# EasyEDA schematic SCH_A320-MCDU-SMD_2024-02-10.json
TITLE: Sheet_1; REV: 1.0; Date: 2021-11-16; Sheet: 1/1; Drawn By: madmonkeyfpv; Company: Your Company
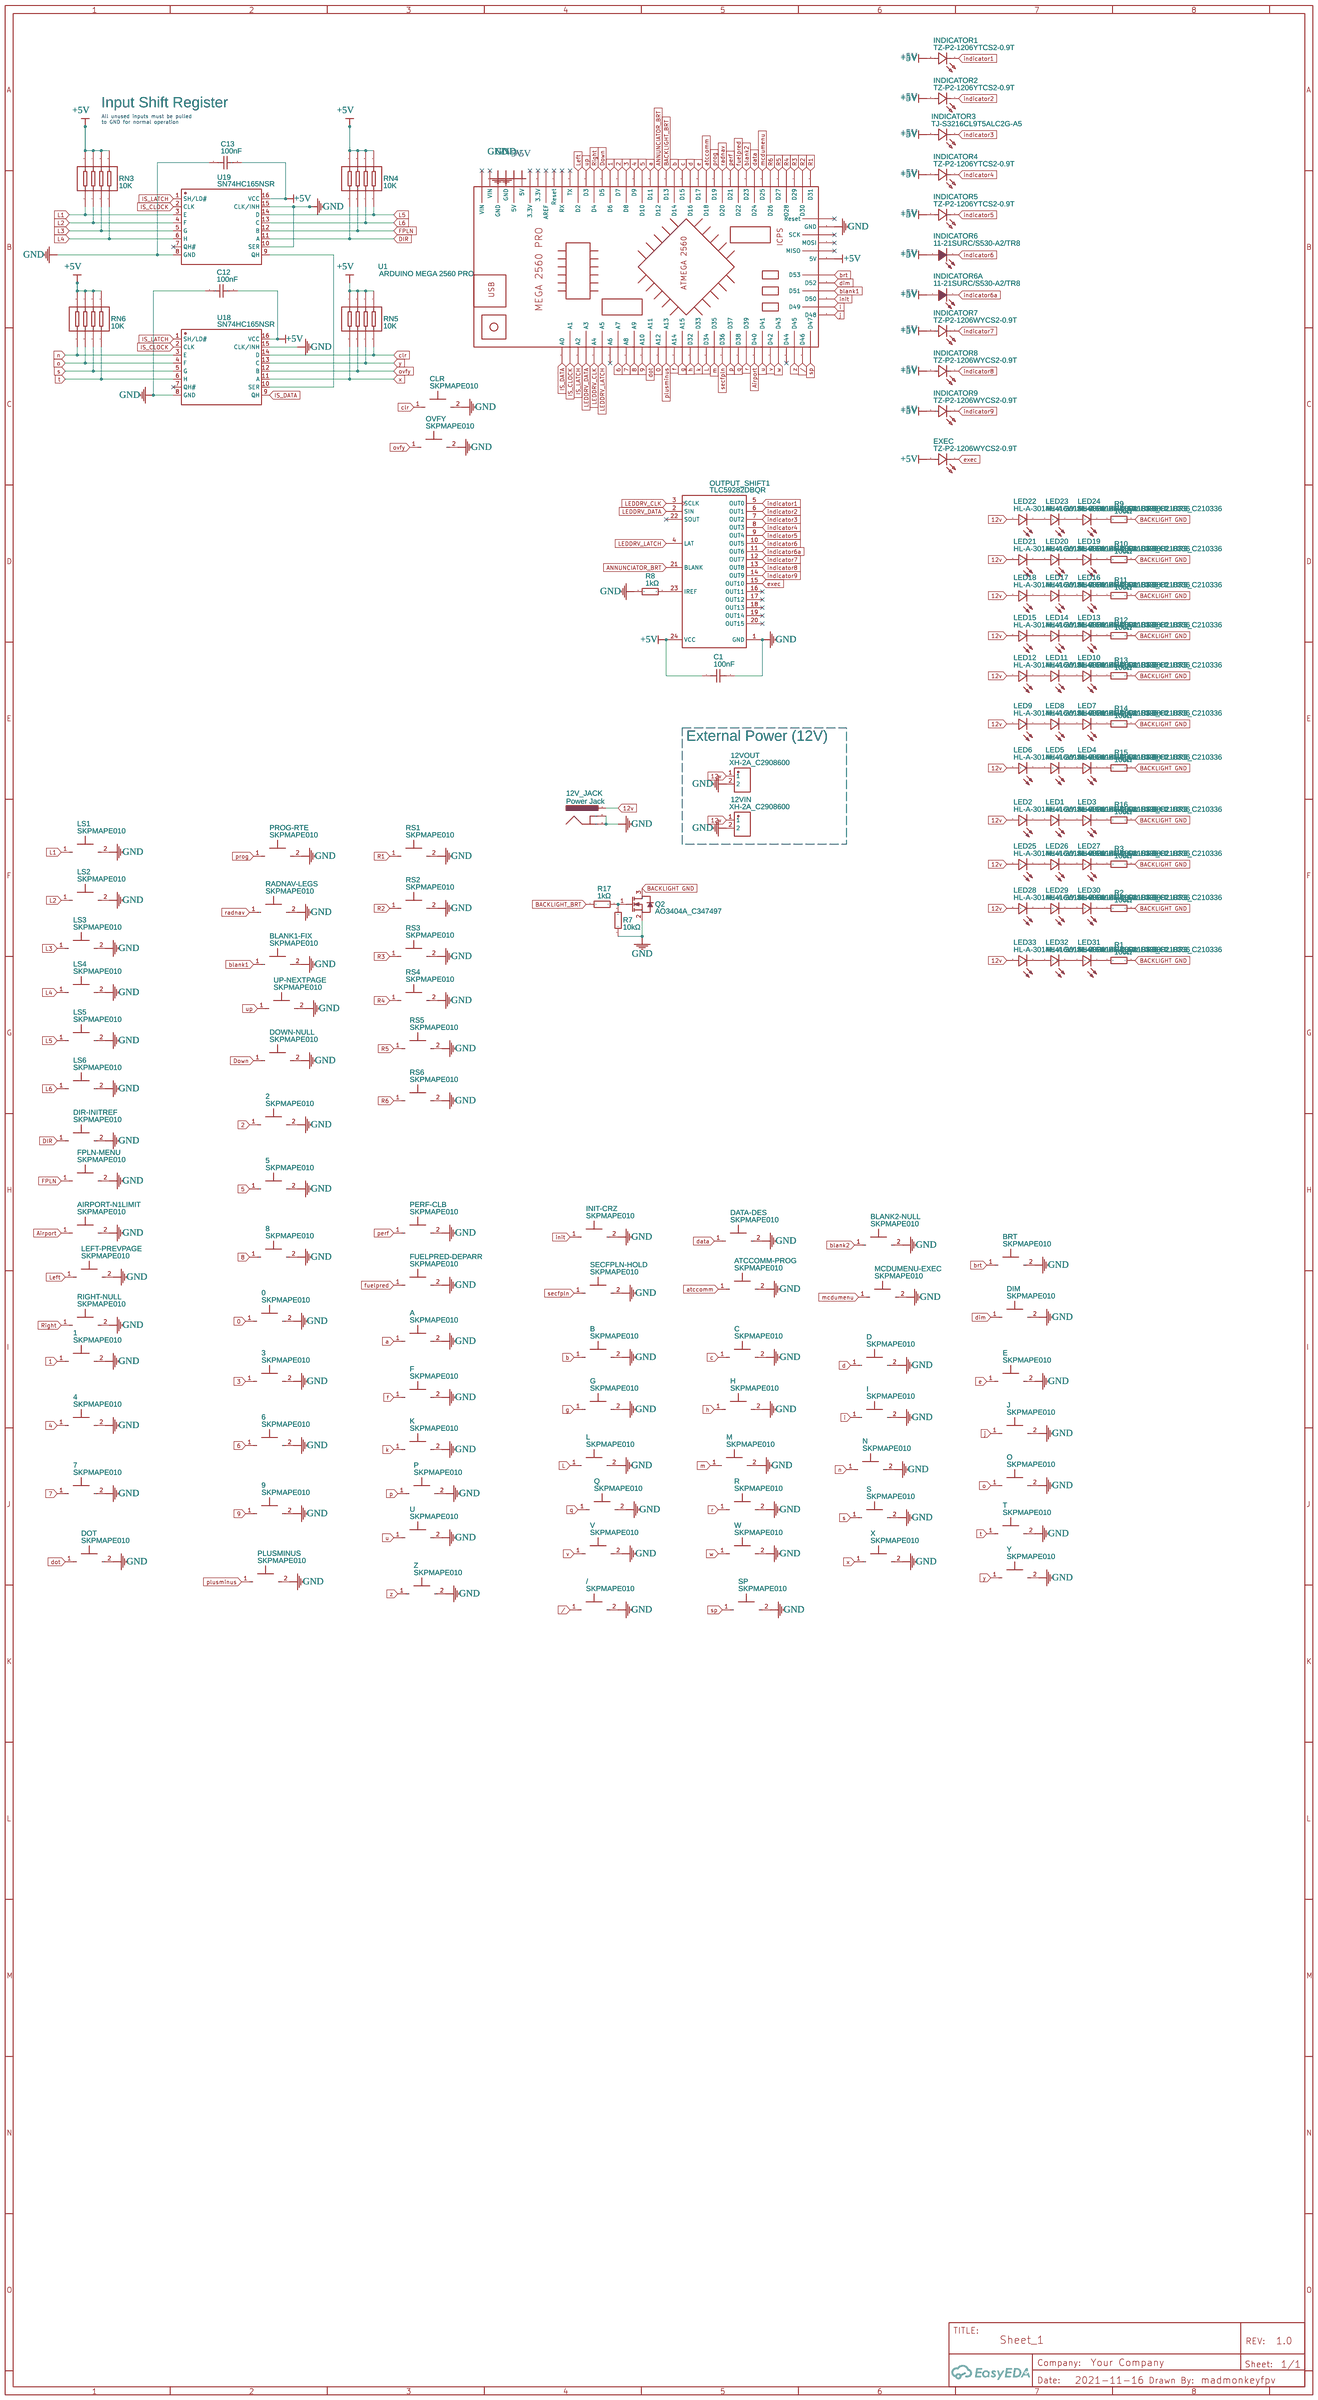
[diagram p0: schematic sheet]

## Parts
0  SKPMAPE010  [KEY-SMD_2P-L6.0-W6.0-P6.00]
1  SKPMAPE010  [KEY-SMD_2P-L6.0-W6.0-P6.00]
2  SKPMAPE010  [KEY-SMD_2P-L6.0-W6.0-P6.00]
3  SKPMAPE010  [KEY-SMD_2P-L6.0-W6.0-P6.00]
4  SKPMAPE010  [KEY-SMD_2P-L6.0-W6.0-P6.00]
5  SKPMAPE010  [KEY-SMD_2P-L6.0-W6.0-P6.00]
6  SKPMAPE010  [KEY-SMD_2P-L6.0-W6.0-P6.00]
7  SKPMAPE010  [KEY-SMD_2P-L6.0-W6.0-P6.00]
8  SKPMAPE010  [KEY-SMD_2P-L6.0-W6.0-P6.00]
9  SKPMAPE010  [KEY-SMD_2P-L6.0-W6.0-P6.00]
12V_JACK  Power Jack  [BARREL_JACK_SLOTTED_HOLES]
12VIN  XH-2A_C2908600  [CONN-TH_2P-P2.50_HCTL_XH-2A-X]
12VOUT  XH-2A_C2908600  [CONN-TH_2P-P2.50_HCTL_XH-2A-X]
/  SKPMAPE010  [KEY-SMD_2P-L6.0-W6.0-P6.00]
A  SKPMAPE010  [KEY-SMD_2P-L6.0-W6.0-P6.00]
AIRPORT-N1LIMIT  SKPMAPE010  [KEY-SMD_2P-L6.0-W6.0-P6.00]
ATCCOMM-PROG  SKPMAPE010  [KEY-SMD_2P-L6.0-W6.0-P6.00]
B  SKPMAPE010  [KEY-SMD_2P-L6.0-W6.0-P6.00]
BLANK1-FIX  SKPMAPE010  [KEY-SMD_2P-L6.0-W6.0-P6.00]
BLANK2-NULL  SKPMAPE010  [KEY-SMD_2P-L6.0-W6.0-P6.00]
BRT  SKPMAPE010  [KEY-SMD_2P-L6.0-W6.0-P6.00]
C  SKPMAPE010  [KEY-SMD_2P-L6.0-W6.0-P6.00]
C1  100nF  [C0603]
C12  100nF  [C0603]
C13  100nF  [C0603]
CLR  SKPMAPE010  [KEY-SMD_2P-L6.0-W6.0-P6.00]
D  SKPMAPE010  [KEY-SMD_2P-L6.0-W6.0-P6.00]
DATA-DES  SKPMAPE010  [KEY-SMD_2P-L6.0-W6.0-P6.00]
DIM  SKPMAPE010  [KEY-SMD_2P-L6.0-W6.0-P6.00]
DIR-INITREF  SKPMAPE010  [KEY-SMD_2P-L6.0-W6.0-P6.00]
DOT  SKPMAPE010  [KEY-SMD_2P-L6.0-W6.0-P6.00]
DOWN-NULL  SKPMAPE010  [KEY-SMD_2P-L6.0-W6.0-P6.00]
E  SKPMAPE010  [KEY-SMD_2P-L6.0-W6.0-P6.00]
EXEC  TZ-P2-1206WYCS2-0.9T  [LED1206-RD_WHITE]
F  SKPMAPE010  [KEY-SMD_2P-L6.0-W6.0-P6.00]
FPLN-MENU  SKPMAPE010  [KEY-SMD_2P-L6.0-W6.0-P6.00]
FUELPRED-DEPARR  SKPMAPE010  [KEY-SMD_2P-L6.0-W6.0-P6.00]
G  SKPMAPE010  [KEY-SMD_2P-L6.0-W6.0-P6.00]
H  SKPMAPE010  [KEY-SMD_2P-L6.0-W6.0-P6.00]
I  SKPMAPE010  [KEY-SMD_2P-L6.0-W6.0-P6.00]
INDICATOR1  TZ-P2-1206YTCS2-0.9T  [LED1206-RD_YELLOW-1]
INDICATOR2  TZ-P2-1206YTCS2-0.9T  [LED1206-RD_YELLOW-1]
INDICATOR3  TJ-S3216CL9T5ALC2G-A5  [LED1206-RD_GREEN]
INDICATOR4  TZ-P2-1206YTCS2-0.9T  [LED1206-RD_YELLOW-1]
INDICATOR5  TZ-P2-1206YTCS2-0.9T  [LED1206-RD_YELLOW-1]
INDICATOR6  11-21SURC/S530-A2/TR8  [LED1206-R-RD_RED]
INDICATOR6A  11-21SURC/S530-A2/TR8  [LED1206-R-RD_RED]
INDICATOR7  TZ-P2-1206WYCS2-0.9T  [LED1206-RD_WHITE]
INDICATOR8  TZ-P2-1206WYCS2-0.9T  [LED1206-RD_WHITE]
INDICATOR9  TZ-P2-1206WYCS2-0.9T  [LED1206-RD_WHITE]
INIT-CRZ  SKPMAPE010  [KEY-SMD_2P-L6.0-W6.0-P6.00]
J  SKPMAPE010  [KEY-SMD_2P-L6.0-W6.0-P6.00]
K  SKPMAPE010  [KEY-SMD_2P-L6.0-W6.0-P6.00]
L  SKPMAPE010  [KEY-SMD_2P-L6.0-W6.0-P6.00]
LED1  HL-A-3014H416W-S1-08HL-HR3_C210336  [LED3014-RD]
LED2  HL-A-3014H416W-S1-08HL-HR3_C210336  [LED3014-RD]
LED3  HL-A-3014H416W-S1-08HL-HR3_C210336  [LED3014-RD]
LED4  HL-A-3014H416W-S1-08HL-HR3_C210336  [LED3014-RD]
LED5  HL-A-3014H416W-S1-08HL-HR3_C210336  [LED3014-RD]
LED6  HL-A-3014H416W-S1-08HL-HR3_C210336  [LED3014-RD]
LED7  HL-A-3014H416W-S1-08HL-HR3_C210336  [LED3014-RD]
LED8  HL-A-3014H416W-S1-08HL-HR3_C210336  [LED3014-RD]
LED9  HL-A-3014H416W-S1-08HL-HR3_C210336  [LED3014-RD]
LED10  HL-A-3014H416W-S1-08HL-HR3_C210336  [LED3014-RD]
LED11  HL-A-3014H416W-S1-08HL-HR3_C210336  [LED3014-RD]
LED12  HL-A-3014H416W-S1-08HL-HR3_C210336  [LED3014-RD]
LED13  HL-A-3014H416W-S1-08HL-HR3_C210336  [LED3014-RD]
LED14  HL-A-3014H416W-S1-08HL-HR3_C210336  [LED3014-RD]
LED15  HL-A-3014H416W-S1-08HL-HR3_C210336  [LED3014-RD]
LED16  HL-A-3014H416W-S1-08HL-HR3_C210336  [LED3014-RD]
LED17  HL-A-3014H416W-S1-08HL-HR3_C210336  [LED3014-RD]
LED18  HL-A-3014H416W-S1-08HL-HR3_C210336  [LED3014-RD]
LED19  HL-A-3014H416W-S1-08HL-HR3_C210336  [LED3014-RD]
LED20  HL-A-3014H416W-S1-08HL-HR3_C210336  [LED3014-RD]
LED21  HL-A-3014H416W-S1-08HL-HR3_C210336  [LED3014-RD]
LED22  HL-A-3014H416W-S1-08HL-HR3_C210336  [LED3014-RD]
LED23  HL-A-3014H416W-S1-08HL-HR3_C210336  [LED3014-RD]
LED24  HL-A-3014H416W-S1-08HL-HR3_C210336  [LED3014-RD]
LED25  HL-A-3014H416W-S1-08HL-HR3_C210336  [LED3014-RD]
LED26  HL-A-3014H416W-S1-08HL-HR3_C210336  [LED3014-RD]
LED27  HL-A-3014H416W-S1-08HL-HR3_C210336  [LED3014-RD]
LED28  HL-A-3014H416W-S1-08HL-HR3_C210336  [LED3014-RD]
LED29  HL-A-3014H416W-S1-08HL-HR3_C210336  [LED3014-RD]
LED30  HL-A-3014H416W-S1-08HL-HR3_C210336  [LED3014-RD]
LED31  HL-A-3014H416W-S1-08HL-HR3_C210336  [LED3014-RD]
LED32  HL-A-3014H416W-S1-08HL-HR3_C210336  [LED3014-RD]
LED33  HL-A-3014H416W-S1-08HL-HR3_C210336  [LED3014-RD]
LEFT-PREVPAGE  SKPMAPE010  [KEY-SMD_2P-L6.0-W6.0-P6.00]
LS1  SKPMAPE010  [KEY-SMD_2P-L6.0-W6.0-P6.00]
LS2  SKPMAPE010  [KEY-SMD_2P-L6.0-W6.0-P6.00]
LS3  SKPMAPE010  [KEY-SMD_2P-L6.0-W6.0-P6.00]
LS4  SKPMAPE010  [KEY-SMD_2P-L6.0-W6.0-P6.00]
LS5  SKPMAPE010  [KEY-SMD_2P-L6.0-W6.0-P6.00]
LS6  SKPMAPE010  [KEY-SMD_2P-L6.0-W6.0-P6.00]
M  SKPMAPE010  [KEY-SMD_2P-L6.0-W6.0-P6.00]
MCDUMENU-EXEC  SKPMAPE010  [KEY-SMD_2P-L6.0-W6.0-P6.00]
N  SKPMAPE010  [KEY-SMD_2P-L6.0-W6.0-P6.00]
O  SKPMAPE010  [KEY-SMD_2P-L6.0-W6.0-P6.00]
OUTPUT_SHIFT1  TLC59282DBQR  [SSOP-24_L8.8-W4.0-P0.64-LS6.2-BL]
OVFY  SKPMAPE010  [KEY-SMD_2P-L6.0-W6.0-P6.00]
P  SKPMAPE010  [KEY-SMD_2P-L6.0-W6.0-P6.00]
PERF-CLB  SKPMAPE010  [KEY-SMD_2P-L6.0-W6.0-P6.00]
PLUSMINUS  SKPMAPE010  [KEY-SMD_2P-L6.0-W6.0-P6.00]
PROG-RTE  SKPMAPE010  [KEY-SMD_2P-L6.0-W6.0-P6.00]
Q  SKPMAPE010  [KEY-SMD_2P-L6.0-W6.0-P6.00]
Q2  AO3404A_C347497  [SOT-23-3_L3.0-W1.7-P0.95-LS2.9-BR]
R  SKPMAPE010  [KEY-SMD_2P-L6.0-W6.0-P6.00]
R1  100Ω  [R1206]
R2  100Ω  [R1206]
R3  100Ω  [R1206]
R7  10kΩ  [R1206]
R8  1kΩ  [R1206]
R9  100Ω  [R1206]
R10  100Ω  [R1206]
R11  100Ω  [R1206]
R12  100Ω  [R1206]
R13  100Ω  [R1206]
R14  100Ω  [R1206]
R15  100Ω  [R1206]
R16  100Ω  [R1206]
R17  1kΩ  [R1206]
RADNAV-LEGS  SKPMAPE010  [KEY-SMD_2P-L6.0-W6.0-P6.00]
RIGHT-NULL  SKPMAPE010  [KEY-SMD_2P-L6.0-W6.0-P6.00]
RN3  10K  [RES-ARRAY-SMD_0603-8P-L3.2-W1.6-BL]
RN4  10K  [RES-ARRAY-SMD_0603-8P-L3.2-W1.6-BL]
RN5  10K  [RES-ARRAY-SMD_0603-8P-L3.2-W1.6-BL]
RN6  10K  [RES-ARRAY-SMD_0603-8P-L3.2-W1.6-BL]
RS1  SKPMAPE010  [KEY-SMD_2P-L6.0-W6.0-P6.00]
RS2  SKPMAPE010  [KEY-SMD_2P-L6.0-W6.0-P6.00]
RS3  SKPMAPE010  [KEY-SMD_2P-L6.0-W6.0-P6.00]
RS4  SKPMAPE010  [KEY-SMD_2P-L6.0-W6.0-P6.00]
RS5  SKPMAPE010  [KEY-SMD_2P-L6.0-W6.0-P6.00]
RS6  SKPMAPE010  [KEY-SMD_2P-L6.0-W6.0-P6.00]
S  SKPMAPE010  [KEY-SMD_2P-L6.0-W6.0-P6.00]
SECFPLN-HOLD  SKPMAPE010  [KEY-SMD_2P-L6.0-W6.0-P6.00]
SP  SKPMAPE010  [KEY-SMD_2P-L6.0-W6.0-P6.00]
T  SKPMAPE010  [KEY-SMD_2P-L6.0-W6.0-P6.00]
U  SKPMAPE010  [KEY-SMD_2P-L6.0-W6.0-P6.00]
U1  ARDUINO MEGA 2560 PRO  [ARDUINO MEGA 2560 PRO]
U18  SN74HC165NSR  [SOP-16_L10.3-W5.4-P1.27-LS7.8-BL]
U19  SN74HC165NSR  [SOP-16_L10.3-W5.4-P1.27-LS7.8-BL]
UP-NEXTPAGE  SKPMAPE010  [KEY-SMD_2P-L6.0-W6.0-P6.00]
V  SKPMAPE010  [KEY-SMD_2P-L6.0-W6.0-P6.00]
W  SKPMAPE010  [KEY-SMD_2P-L6.0-W6.0-P6.00]
X  SKPMAPE010  [KEY-SMD_2P-L6.0-W6.0-P6.00]
Y  SKPMAPE010  [KEY-SMD_2P-L6.0-W6.0-P6.00]
Z  SKPMAPE010  [KEY-SMD_2P-L6.0-W6.0-P6.00]

## Library data of the parts
0-9 / A AIRPORT-N1LIMIT ATCCOMM-PROG B BLANK1-FIX BLANK2-NULL BRT C CLR D DATA-DES DIM DIR-INITREF DOT DOWN-NULL E F FPLN-MENU FUELPRED-DEPARR G H I INIT-CRZ J K L LEFT-PREVPAGE LS1-LS6 M MCDUMENU-EXEC N O OVFY P PERF-CLB PLUSMINUS PROG-RTE Q R RADNAV-LEGS RIGHT-NULL RS1-RS6 S SECFPLN-HOLD SP T U UP-NEXTPAGE V W X Y Z = SKPMAPE010: Supplier: LCSC; Manufacturer: ALPS; Supplier Part: C110292; JLCPCB Part Class: Extended Part
12V_JACK = POWER_JACK: Contributor: SparkFun; Supplier: Tayda Electronics; Supplier Part: A-4118; Manufacturer: Wealth Metal; Package Display: No
12VIN 12VOUT = XH-2A_C2908600: Supplier: LCSC; Supplier Part: C2908600; Manufacturer: HCTL(华灿天禄); Manufacturer Part: XH-2A; Contributor: LCSC; JLCPCB Part Class: Extended Part
C1 C12 C13 = CC0603KRX7R9BB104: Supplier: LCSC; Manufacturer: YAGEO; Supplier Part: C14663; JLCPCB Part Class: Basic Part
EXEC INDICATOR7-INDICATOR9 = TZ-P2-1206WYCS2-0.9T: Supplier: LCSC; Supplier Part: C779809; Manufacturer: TUOZHAN; Contributor: LCSC; JLCPCB Part Class: Extended Part
INDICATOR1 INDICATOR2 INDICATOR4 INDICATOR5 = TZ-P2-1206YTCS2-0.9T: Supplier: LCSC; Supplier Part: C779811; Manufacturer: TUOZHAN; Contributor: LCSC; JLCPCB Part Class: Extended Part
INDICATOR3 = TJ-S3216CL9T5ALC2G-A5: Supplier: LCSC; Supplier Part: C917196; Manufacturer: TOGIALED; Contributor: LCSC; JLCPCB Part Class: Extended Part
INDICATOR6 INDICATOR6A = 11-21SURC/S530-A2/TR8: Supplier: LCSC; Supplier Part: C264315; Manufacturer: Everlight Elec; Contributor: LCSC; JLCPCB Part Class: Extended Part
LED1-LED33 = HL-A-3014H416W-S1-08HL-HR3_C210336: Supplier: LCSC; Supplier Part: C210336; Manufacturer: Hongli Zhihui (HONGLITRONIC); Contributor: LCSC; JLCPCB Part Class: Extended Part
OUTPUT_SHIFT1 = TLC59282DBQR: Supplier: LCSC; Manufacturer: TI(德州仪器); Supplier Part: C129352; JLCPCB Part Class: Extended Part
Q2 = AO3404A_C347497: Supplier: LCSC; Supplier Part: C347497; Manufacturer: Youtai Semiconductor Co., Ltd.; Manufacturer Part: AO3404A; Contributor: LCSC; JLCPCB Part Class: Extended Part
R1-R3 R9-R16 = 1206W4F1000T5E: Supplier: LCSC; Manufacturer: UniOhm; Supplier Part: C17901; Resistance (Ohms): 100; JLCPCB Part Class: Basic Part
R7 = 1206W4F1002T5E: Supplier: LCSC; Manufacturer: UniOhm; Supplier Part: C17902; Resistance (Ohms): 10K; JLCPCB Part Class: Basic Part
R8 R17 = 1206W4F1001T5E: Supplier: LCSC; Manufacturer: UniOhm; Supplier Part: C4410; Resistance (Ohms): 1K; JLCPCB Part Class: Basic Part
RN3-RN6 = YC164-FR-0710KL: Supplier: LCSC; Manufacturer: YAGEO; Supplier Part: C110924; JLCPCB Part Class: Extended Part; Resistance: 10kΩ
U1 = ARDUINO MEGA 2560 PRO: Manufacturer Part: Arduino Mega 2560 Pro Mini; link: https://www.arduino.cc; Contributor: DEVAZ
U18 U19 = SN74HC165NSR: Supplier: LCSC; Manufacturer: TI; Supplier Part: C129935; JLCPCB Part Class: Extended Part

## Nets
12v: 12V_JACK.PWR 12VIN.1 12VOUT.1 LED2.2 LED6.2 LED9.2 LED12.2 LED15.2 LED18.2 LED21.2 LED22.2 LED25.2 LED28.2 LED33.2
+5V: C1.1 C12.2 C13.2 EXEC.2(A) INDICATOR1.2(A) INDICATOR2.2(A) INDICATOR3.2(A) INDICATOR4.2(A) INDICATOR5.2(A) INDICATOR6.1(A) INDICATOR6A.1(A) INDICATOR7.2(A) INDICATOR8.2(A) INDICATOR9.2(A) OUTPUT_SHIFT1.24(VCC) RN3.5 RN3.6 RN3.7 RN3.8 RN4.1 RN4.2 RN4.3 RN4.4 RN5.1 RN5.2 RN5.3 RN5.4 RN6.5 RN6.6 RN6.7 RN6.8 U1.39(5V) U1.81(5V) U1.82(5V) U18.16(VCC) U19.16(VCC)
GND: 0.2 1.2 2.2 3.2 4.2 5.2 6.2 7.2 8.2 9.2 12V_JACK.GND 12V_JACK.GNDBREAK 12VIN.2 12VOUT.2 /.2 A.2 AIRPORT-N1LIMIT.2 ATCCOMM-PROG.2 B.2 BLANK1-FIX.2 BLANK2-NULL.2 BRT.2 C.2 C1.2 C12.1 C13.1 CLR.2 D.2 DATA-DES.2 DIM.2 DIR-INITREF.2 DOT.2 DOWN-NULL.2 E.2 F.2 FPLN-MENU.2 FUELPRED-DEPARR.2 G.2 H.2 I.2 INIT-CRZ.2 J.2 K.2 L.2 LEFT-PREVPAGE.2 LS1.2 LS2.2 LS3.2 LS4.2 LS5.2 LS6.2 M.2 MCDUMENU-EXEC.2 N.2 O.2 OUTPUT_SHIFT1.1(GND) OVFY.2 P.2 PERF-CLB.2 PLUSMINUS.2 PROG-RTE.2 Q.2 Q2.2(S) R.2 R7.1 R8.2 RADNAV-LEGS.2 RIGHT-NULL.2 RS1.2 RS2.2 RS3.2 RS4.2 RS5.2 RS6.2 S.2 SECFPLN-HOLD.2 SP.2 T.2 U.2 U1.43(GND) U1.83(GND) U1.84(GND) U18.8(GND) U18.15(CLK/INH) U19.8(GND) U19.10(SER) U19.15(CLK/INH) UP-NEXTPAGE.2 V.2 W.2 X.2 Y.2 Z.2
0: 0.1 U1.13(A12)
1: 1.1 U1.70(D6)
2: 2.1 U1.69(D7)
3: 3.1 U1.68(D8)
4: 4.1 U1.67(D9)
5: 5.1 U1.66(D10)
6: 6.1 U1.8(A7)
7: 7.1 U1.9(A8)
8: 8.1 U1.10(A9)
9: 9.1 U1.11(A10)
/: /.1 U1.31(D46)
a: A.1 U1.65(D11)
Airport: AIRPORT-N1LIMIT.1 U1.25(D40)
ANNUNCIATOR_BRT: OUTPUT_SHIFT1.21(BLANK) U1.64(D12)
atccomm: ATCCOMM-PROG.1 U1.58(D18)
b: B.1 U1.62(D14)
BACKLIGHT GND: Q2.3(D) R1.2 R2.2 R3.2 R9.2 R10.2 R11.2 R12.2 R13.2 R14.2 R15.2 R16.2
BACKLIGHT_BRT: R17.1 U1.63(D13)
blank1: BLANK1-FIX.1 U1.36(D51)
blank2: BLANK2-NULL.1 U1.53(D23)
brt: BRT.1 U1.38(D53)
c: C.1 U1.61(D15)
clr: CLR.1 RN5.8 U18.14(D)
d: D.1 U1.60(D16)
data: DATA-DES.1 U1.52(D24)
dim: DIM.1 U1.37(D52)
DIR: DIR-INITREF.1 RN4.5 U19.11(A)
dot: DOT.1 U1.12(A11)
Down: DOWN-NULL.1 U1.71(D5)
e: E.1 U1.59(D17)
exec: EXEC.1(K) OUTPUT_SHIFT1.15(OUT10)
f: F.1 U1.15(A14)
FPLN: FPLN-MENU.1 RN4.6 U19.12(B)
fuelpred: FUELPRED-DEPARR.1 U1.54(D22)
g: G.1 U1.16(A15)
h: H.1 U1.17(D32)
i: I.1 U1.34(D49)
indicator1: INDICATOR1.1(K) OUTPUT_SHIFT1.5(OUT0)
indicator2: INDICATOR2.1(K) OUTPUT_SHIFT1.6(OUT1)
indicator3: INDICATOR3.1(K) OUTPUT_SHIFT1.7(OUT2)
indicator4: INDICATOR4.1(K) OUTPUT_SHIFT1.8(OUT3)
indicator5: INDICATOR5.1(K) OUTPUT_SHIFT1.9(OUT4)
indicator6: INDICATOR6.2(K) OUTPUT_SHIFT1.10(OUT5)
indicator6a: INDICATOR6A.2(K) OUTPUT_SHIFT1.11(OUT6)
indicator7: INDICATOR7.1(K) OUTPUT_SHIFT1.12(OUT7)
indicator8: INDICATOR8.1(K) OUTPUT_SHIFT1.13(OUT8)
indicator9: INDICATOR9.1(K) OUTPUT_SHIFT1.14(OUT9)
init: INIT-CRZ.1 U1.35(D50)
IS_CLOCK: U1.2(A1) U18.2(CLK) U19.2(CLK)
IS_DATA: U1.1(A0) U18.9(QH)
IS_LATCH: U1.3(A2) U18.1(SH/LD#) U19.1(SH/LD#)
j: J.1 U1.33(D48)
k: K.1 U1.18(D33)
L: L.1 U1.19(D34)
L1: LS1.1 RN3.1 U19.3(E)
L2: LS2.1 RN3.2 U19.4(F)
L3: LS3.1 RN3.3 U19.5(G)
L4: LS4.1 RN3.4 U19.6(H)
L5: LS5.1 RN4.8 U19.14(D)
L6: LS6.1 RN4.7 U19.13(C)
LEDDRV_CLK: OUTPUT_SHIFT1.3(SCLK) U1.5(A4)
LEDDRV_DATA: OUTPUT_SHIFT1.2(SIN) U1.4(A3)
LEDDRV_LATCH: OUTPUT_SHIFT1.4(LAT) U1.6(A5)
Left: LEFT-PREVPAGE.1 U1.74(D2)
m: M.1 U1.20(D35)
mcdumenu: MCDUMENU-EXEC.1 U1.51(D25)
n: N.1 RN6.1 U18.3(E)
o: O.1 RN6.2 U18.4(F)
ovfy: OVFY.1 RN5.6 U18.12(B)
p: P.1 U1.22(D37)
perf: PERF-CLB.1 U1.55(D21)
plusminus: PLUSMINUS.1 U1.14(A13)
prog: PROG-RTE.1 U1.57(D19)
q: Q.1 U1.23(D38)
r: R.1 U1.24(D39)
R1: RS1.1 U1.45(D31)
R2: RS2.1 U1.46(D30)
R3: RS3.1 U1.47(D29)
R4: RS4.1 U1.48(D28)
R5: RS5.1 U1.49(D27)
R6: RS6.1 U1.50(D26)
radnav: RADNAV-LEGS.1 U1.56(D20)
Right: RIGHT-NULL.1 U1.72(D4)
s: RN6.3 S.1 U18.5(G)
secfpln: SECFPLN-HOLD.1 U1.21(D36)
sp: SP.1 U1.32(D47)
t: RN6.4 T.1 U18.6(H)
u: U.1 U1.26(D41)
up: U1.73(D3) UP-NEXTPAGE.1
v: U1.27(D42) V.1
w: U1.28(D43) W.1
x: RN5.5 U18.11(A) X.1
y: RN5.7 U18.13(C) Y.1
z: U1.30(D45) Z.1
Net-(LED1-1): LED1.1 LED3.2
Net-(LED1-2): LED1.2 LED2.1
Net-(LED3-1): LED3.1 R16.1
Net-(LED4-1): LED4.1 R15.1
Net-(LED4-2): LED4.2 LED5.1
Net-(LED5-2): LED5.2 LED6.1
Net-(LED7-1): LED7.1 R14.1
Net-(LED7-2): LED7.2 LED8.1
Net-(LED8-2): LED8.2 LED9.1
Net-(LED10-1): LED10.1 R13.1
Net-(LED10-2): LED10.2 LED11.1
Net-(LED11-2): LED11.2 LED12.1
Net-(LED13-1): LED13.1 R12.1
Net-(LED13-2): LED13.2 LED14.1
Net-(LED14-2): LED14.2 LED15.1
Net-(LED16-1): LED16.1 R11.1
Net-(LED16-2): LED16.2 LED17.1
Net-(LED17-2): LED17.2 LED18.1
Net-(LED19-1): LED19.1 R10.1
Net-(LED19-2): LED19.2 LED20.1
Net-(LED20-2): LED20.2 LED21.1
Net-(LED22-1): LED22.1 LED23.2
Net-(LED23-1): LED23.1 LED24.2
Net-(LED24-1): LED24.1 R9.1
Net-(LED25-1): LED25.1 LED26.2
Net-(LED26-1): LED26.1 LED27.2
Net-(LED27-1): LED27.1 R3.1
Net-(LED28-1): LED28.1 LED29.2
Net-(LED29-1): LED29.1 LED30.2
Net-(LED30-1): LED30.1 R2.1
Net-(LED31-1): LED31.1 R1.1
Net-(LED31-2): LED31.2 LED32.1
Net-(LED32-2): LED32.2 LED33.1
Net-(OUTPUT_SHIFT1-23): OUTPUT_SHIFT1.23(IREF) R8.1
Net-(Q2-1): Q2.1(G) R7.2 R17.2
Net-(U18-10): U18.10(SER) U19.9(QH)

Not connected (* = marked no-connect by the designer): OUTPUT_SHIFT1 16(OUT11)* 17(OUT12)* 18(OUT13)* 19(OUT14)* 20(OUT15)* 22(SOUT)*; U1 7(A6)* 29(D44)* 40(MISO)* 41(MOSI)* 42(SCK)* 44(Reset)* 75(TX)* 76(RX)* 77(Reset)* 78(AREF)* 79(3.3V)* 80(3.3V)* 85(VIN)* 86(VIN)*; U18 7(QH#)*; U19 7(QH#)*

## Notes on the sheet
- +5V
- +5V
- Input Shift Register
- All unused inputs must be pulled
  to GND for normal operation
- +5V
- +5V
- +5V
- +5V
- +5V
- +5V
- +5V
- +5V
- External Power (12V)
